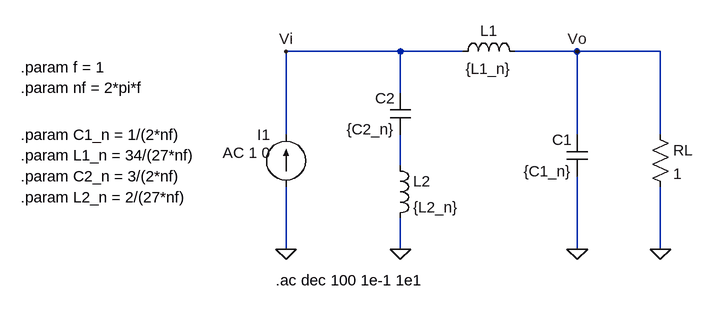
[diagram p0: schematic TPS12_ej2.asc]
TPS12_ej2.asc, the LTspice schematic file:
Version 4
SHEET 1 880 680
WIRE -1040 -544 -1216 -544
WIRE -944 -544 -1040 -544
WIRE -768 -544 -864 -544
WIRE -640 -544 -768 -544
WIRE -1040 -480 -1040 -544
WIRE -1216 -416 -1216 -544
WIRE -768 -416 -768 -544
WIRE -640 -416 -640 -544
WIRE -1040 -368 -1040 -416
WIRE -1216 -240 -1216 -336
WIRE -1040 -240 -1040 -288
WIRE -768 -240 -768 -352
WIRE -640 -240 -640 -336
FLAG -1216 -240 0
FLAG -1040 -240 0
FLAG -768 -240 0
FLAG -1216 -544 Vi
FLAG -640 -240 0
FLAG -768 -544 Vo
SYMBOL cap -1024 -416 R180
WINDOW 0 24 56 Left 2
WINDOW 3 24 8 Left 2
SYMATTR InstName C2
SYMATTR Value {C2_n}
SYMBOL cap -752 -352 R180
WINDOW 0 24 56 Left 2
WINDOW 3 24 8 Left 2
SYMATTR InstName C1
SYMATTR Value {C1_n}
SYMBOL ind -1056 -384 R0
SYMATTR InstName L2
SYMATTR Value {L2_n}
SYMBOL ind -960 -528 R270
WINDOW 0 32 56 VTop 2
WINDOW 3 5 56 VBottom 2
SYMATTR InstName L1
SYMATTR Value {L1_n}
SYMBOL res -656 -432 R0
SYMATTR InstName RL
SYMATTR Value 1
SYMBOL current -1216 -336 R180
WINDOW 0 24 80 Left 2
WINDOW 3 24 0 Left 2
WINDOW 123 24 52 Left 2
WINDOW 39 0 0 Left 2
SYMATTR InstName I1
SYMATTR Value ""
SYMATTR Value2 AC 1 0
TEXT -1232 -192 Left 2 !.ac dec 100 1e-1 1e1
TEXT -1624 -416 Left 2 !.param C1_n = 1/(2*nf)
TEXT -1624 -352 Left 2 !.param C2_n = 3/(2*nf)
TEXT -1624 -384 Left 2 !.param L1_n = 34/(27*nf)
TEXT -1624 -520 Left 2 !.param f = 1
TEXT -1624 -488 Left 2 !.param nf = 2*pi*f
TEXT -1624 -320 Left 2 !.param L2_n = 2/(27*nf)

The netlist it stands for:
* TPS12_ej2.asc
C2 N001 Vi {C2_n}
C1 0 Vo {C1_n}
L2 N001 0 {L2_n}
L1 Vi Vo {L1_n}
RL Vo 0 1
I1 0 Vi AC 1 0
.ac dec 100 1e-1 1e1
.param C1_n = 1/(2*nf)
.param C2_n = 3/(2*nf)
.param L1_n = 34/(27*nf)
.param f = 1
.param nf = 2*pi*f
.param L2_n = 2/(27*nf)
.backanno
.end

* Results of the author's LTspice run, read from the files saved beside the schematic
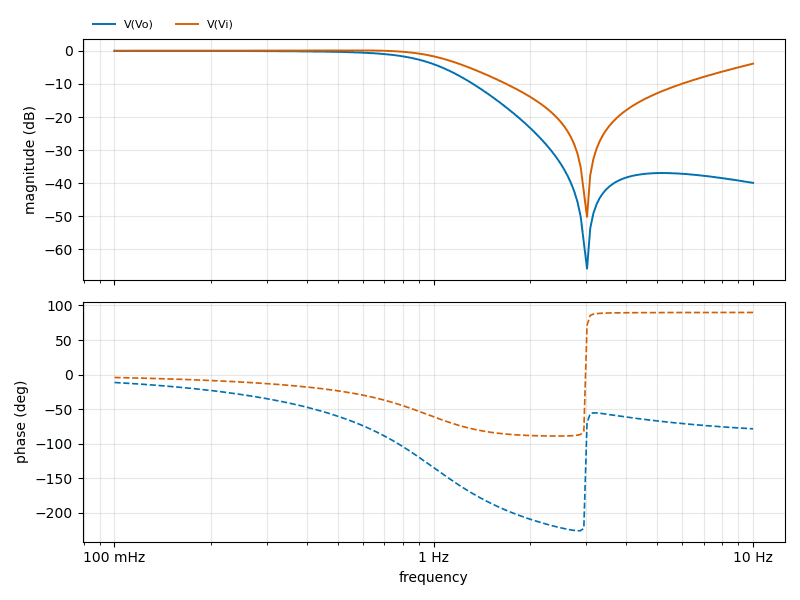
[diagram p1: AC Analysis of TPS12_ej2.asc, plotted from the saved traces]
* AC Analysis, 1 run:
*   V(Vo): -0.01 dB at 100 mHz, -39.90 dB at 10 Hz, peak -0.01 dB at 100 mHz, 3 dB below the peak at 926.4 mHz
*   V(Vi): 0.01 dB at 100 mHz, -3.89 dB at 10 Hz, peak 0.13 dB at 549.5 mHz, 3 dB below the peak at 1.112 Hz